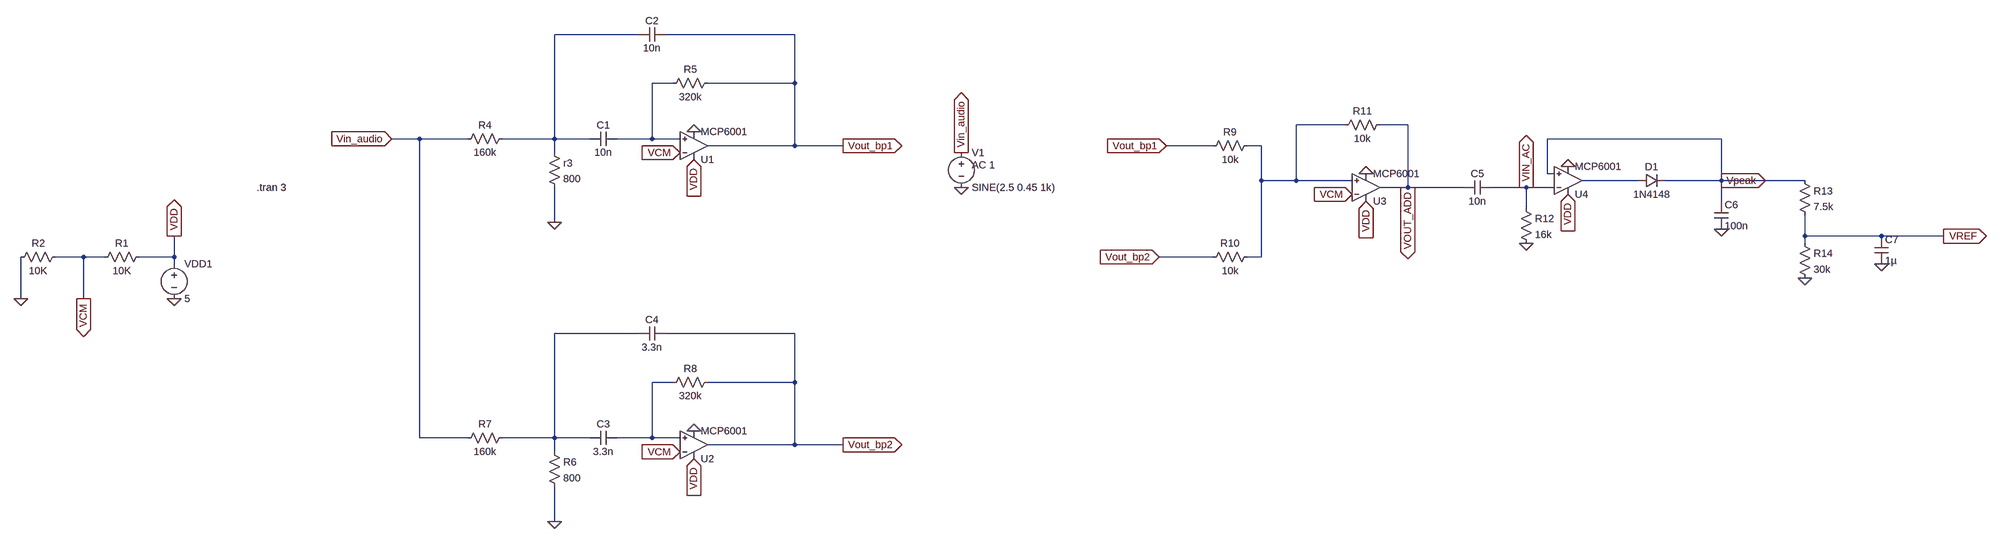
[diagram p0: schematic prelab_7.asc]
prelab_7.asc, the LTspice schematic file:
Version 4.1
SHEET 1 4232 680
WIRE 144 -624 -48 -624
WIRE 512 -624 208 -624
WIRE 224 -512 176 -512
WIRE 512 -512 512 -624
WIRE 512 -512 304 -512
WIRE 2736 -416 2624 -416
WIRE 2880 -416 2816 -416
WIRE -368 -384 -432 -384
WIRE -256 -384 -368 -384
WIRE -48 -384 -48 -624
WIRE -48 -384 -176 -384
WIRE 32 -384 -48 -384
WIRE 176 -384 176 -512
WIRE 176 -384 96 -384
WIRE 240 -384 176 -384
WIRE 3600 -384 3200 -384
WIRE 512 -368 512 -512
WIRE 512 -368 304 -368
WIRE 736 -368 512 -368
WIRE 2432 -368 2160 -368
WIRE 2544 -368 2512 -368
WIRE -48 -352 -48 -384
WIRE 3200 -304 3200 -384
WIRE 3216 -304 3200 -304
WIRE 2544 -288 2544 -368
WIRE 2624 -288 2624 -416
WIRE 2624 -288 2544 -288
WIRE 2752 -288 2624 -288
WIRE 3408 -288 3280 -288
WIRE 3600 -288 3600 -384
WIRE 3600 -288 3472 -288
WIRE 3792 -288 3600 -288
WIRE 2880 -272 2880 -416
WIRE 2880 -272 2816 -272
WIRE 3008 -272 2880 -272
WIRE 3152 -272 3072 -272
WIRE 3216 -272 3152 -272
WIRE 3600 -240 3600 -288
WIRE 3152 -224 3152 -272
WIRE -48 -192 -48 -272
WIRE 3792 -160 3792 -208
WIRE 3968 -160 3792 -160
WIRE 4112 -160 3968 -160
WIRE 3792 -144 3792 -160
WIRE -1408 -112 -1472 -112
WIRE -1360 -112 -1408 -112
WIRE -1200 -112 -1200 -160
WIRE -1200 -112 -1280 -112
WIRE 2432 -112 2144 -112
WIRE 2544 -112 2544 -288
WIRE 2544 -112 2512 -112
WIRE -1200 -96 -1200 -112
WIRE -1552 -16 -1552 -112
WIRE -1408 -16 -1408 -112
WIRE 144 64 -48 64
WIRE 512 64 208 64
WIRE 224 176 176 176
WIRE 512 176 512 64
WIRE 512 176 304 176
WIRE -368 304 -368 -384
WIRE -256 304 -368 304
WIRE -48 304 -48 64
WIRE -48 304 -176 304
WIRE 32 304 -48 304
WIRE 176 304 176 176
WIRE 176 304 96 304
WIRE 240 304 176 304
WIRE 512 320 512 176
WIRE 512 320 304 320
WIRE 736 320 512 320
WIRE -48 336 -48 304
WIRE -48 496 -48 416
FLAG -1200 -16 0
FLAG -1200 -160 VDD
IOPIN -1200 -160 Out
FLAG -1408 -16 VCM
IOPIN -1408 -16 Out
FLAG -1552 -16 0
FLAG 736 -368 Vout_bp1
IOPIN 736 -368 Out
FLAG -48 -192 0
FLAG -432 -384 Vin_audio
IOPIN -432 -384 In
FLAG 240 -352 VCM
IOPIN 240 -352 In
FLAG 736 320 Vout_bp2
IOPIN 736 320 Out
FLAG -48 496 0
FLAG 240 336 VCM
IOPIN 240 336 In
FLAG 272 -336 VDD
IOPIN 272 -336 In
FLAG 272 352 VDD
IOPIN 272 352 In
FLAG 272 -400 0
FLAG 272 288 0
FLAG 1328 -272 0
FLAG 1328 -352 Vin_audio
IOPIN 1328 -352 Out
FLAG 2160 -368 Vout_bp1
IOPIN 2160 -368 In
FLAG 2144 -112 Vout_bp2
IOPIN 2144 -112 In
FLAG 2752 -256 VCM
IOPIN 2752 -256 In
FLAG 3968 -96 0
FLAG 3792 -64 0
FLAG 3600 -176 0
FLAG 3152 -144 0
FLAG 2784 -304 0
FLAG 3248 -320 0
FLAG 4112 -160 VREF
IOPIN 4112 -160 Out
FLAG 2880 -272 VOUT_ADD
IOPIN 2880 -272 Out
FLAG 2784 -240 VDD
IOPIN 2784 -240 In
FLAG 3248 -256 VDD
IOPIN 3248 -256 In
FLAG 3600 -288 Vpeak
IOPIN 3600 -288 Out
FLAG 3152 -272 VIN_AC
IOPIN 3152 -272 Out
SYMBOL voltage -1200 -112 R0
WINDOW 123 0 0 Left 0
WINDOW 39 0 0 Left 0
SYMATTR InstName VDD1
SYMATTR Value 5
SYMBOL res -1264 -128 R90
WINDOW 0 0 56 VBottom 2
WINDOW 3 32 56 VTop 2
SYMATTR InstName R1
SYMATTR Value 10K
SYMBOL res -1456 -128 R90
WINDOW 0 0 56 VBottom 2
WINDOW 3 32 56 VTop 2
SYMATTR InstName R2
SYMATTR Value 10K
SYMBOL MCP6001 272 -368 M180
SYMATTR InstName U1
SYMBOL cap 96 -400 R90
WINDOW 0 0 32 VBottom 2
WINDOW 3 32 32 VTop 2
SYMATTR InstName C1
SYMATTR Value 10n
SYMBOL res -64 -368 R0
SYMATTR InstName r3
SYMATTR Value 800
SYMBOL res -160 -400 R90
WINDOW 0 0 56 VBottom 2
WINDOW 3 32 56 VTop 2
SYMATTR InstName R4
SYMATTR Value 160k
SYMBOL cap 208 -640 R90
WINDOW 0 0 32 VBottom 2
WINDOW 3 32 32 VTop 2
SYMATTR InstName C2
SYMATTR Value 10n
SYMBOL res 320 -528 R90
WINDOW 0 0 56 VBottom 2
WINDOW 3 32 56 VTop 2
SYMATTR InstName R5
SYMATTR Value 320k
SYMBOL MCP6001 272 320 M180
SYMATTR InstName U2
SYMBOL cap 96 288 R90
WINDOW 0 0 32 VBottom 2
WINDOW 3 32 32 VTop 2
SYMATTR InstName C3
SYMATTR Value 3.3n
SYMBOL res -64 320 R0
SYMATTR InstName R6
SYMATTR Value 800
SYMBOL res -160 288 R90
WINDOW 0 0 56 VBottom 2
WINDOW 3 32 56 VTop 2
SYMATTR InstName R7
SYMATTR Value 160k
SYMBOL cap 208 48 R90
WINDOW 0 0 32 VBottom 2
WINDOW 3 32 32 VTop 2
SYMATTR InstName C4
SYMATTR Value 3.3n
SYMBOL res 320 160 R90
WINDOW 0 0 56 VBottom 2
WINDOW 3 32 56 VTop 2
SYMATTR InstName R8
SYMATTR Value 320k
SYMBOL voltage 1328 -368 R0
WINDOW 123 24 44 Left 2
WINDOW 39 0 0 Left 0
SYMATTR Value2 AC 1
SYMATTR InstName V1
SYMATTR Value SINE(2.5 0.45 1k)
SYMBOL res 2528 -384 R90
WINDOW 0 0 56 VBottom 2
WINDOW 3 32 56 VTop 2
SYMATTR InstName R9
SYMATTR Value 10k
SYMBOL res 2528 -128 R90
WINDOW 0 0 56 VBottom 2
WINDOW 3 32 56 VTop 2
SYMATTR InstName R10
SYMATTR Value 10k
SYMBOL MCP6001 2784 -272 M180
SYMATTR InstName U3
SYMBOL res 2832 -432 R90
WINDOW 0 0 56 VBottom 2
WINDOW 3 32 56 VTop 2
SYMATTR InstName R11
SYMATTR Value 10k
SYMBOL cap 3072 -288 R90
WINDOW 0 0 32 VBottom 2
WINDOW 3 32 32 VTop 2
SYMATTR InstName C5
SYMATTR Value 10n
SYMBOL res 3136 -240 R0
SYMATTR InstName R12
SYMATTR Value 16k
SYMBOL MCP6001 3248 -288 M180
SYMATTR InstName U4
SYMBOL diode 3408 -272 R270
WINDOW 0 32 32 VTop 2
WINDOW 3 0 32 VBottom 2
SYMATTR InstName D1
SYMATTR Value 1N4148
SYMBOL cap 3584 -240 R0
SYMATTR InstName C6
SYMATTR Value 100n
SYMBOL res 3776 -304 R0
SYMATTR InstName R13
SYMATTR Value 7.5k
SYMBOL res 3776 -160 R0
SYMATTR InstName R14
SYMATTR Value 30k
SYMBOL cap 3952 -160 R0
SYMATTR InstName C7
SYMATTR Value 1µ
TEXT -904 -272 Left 2 !.tran 3

The netlist it stands for:
* prelab_7.asc
VDD1 VDD 0 5
R1 VDD VCM 10K
R2 VCM 0 10K
* U1: MCP6001 (symbol MCP6001 not available, pins judged from their places): In+=N002 In-=VCM V+=VDD V-=0 OUT=Vout_bp1
C1 N002 N001 10n
r3 N001 0 800
R4 N001 Vin_audio 160k
C2 Vout_bp1 N001 10n
R5 Vout_bp1 N002 320k
* U2: MCP6001 (symbol MCP6001 not available, pins judged from their places): In+=N006 In-=VCM V+=VDD V-=0 OUT=Vout_bp2
C3 N006 N005 3.3n
R6 N005 0 800
R7 N005 Vin_audio 160k
C4 Vout_bp2 N005 3.3n
R8 Vout_bp2 N006 320k
V1 Vin_audio 0 SINE(2.5 0.45 1k) AC 1
R9 N003 Vout_bp1 10k
R10 N003 Vout_bp2 10k
* U3: MCP6001 (symbol MCP6001 not available, pins judged from their places): In+=N003 In-=VCM V+=VDD V-=0 OUT=VOUT_ADD
R11 VOUT_ADD N003 10k
C5 VIN_AC VOUT_ADD 10n
R12 VIN_AC 0 16k
* U4: MCP6001 (symbol MCP6001 not available, pins judged from their places): In+=Vpeak In-=VIN_AC V+=VDD V-=0 OUT=N004
D1 N004 Vpeak 1N4148
C6 Vpeak 0 100n
R13 Vpeak VREF 7.5k
R14 VREF 0 30k
C7 VREF 0 1µ
.model D D
.lib standard.dio
.tran 3
.backanno
.end